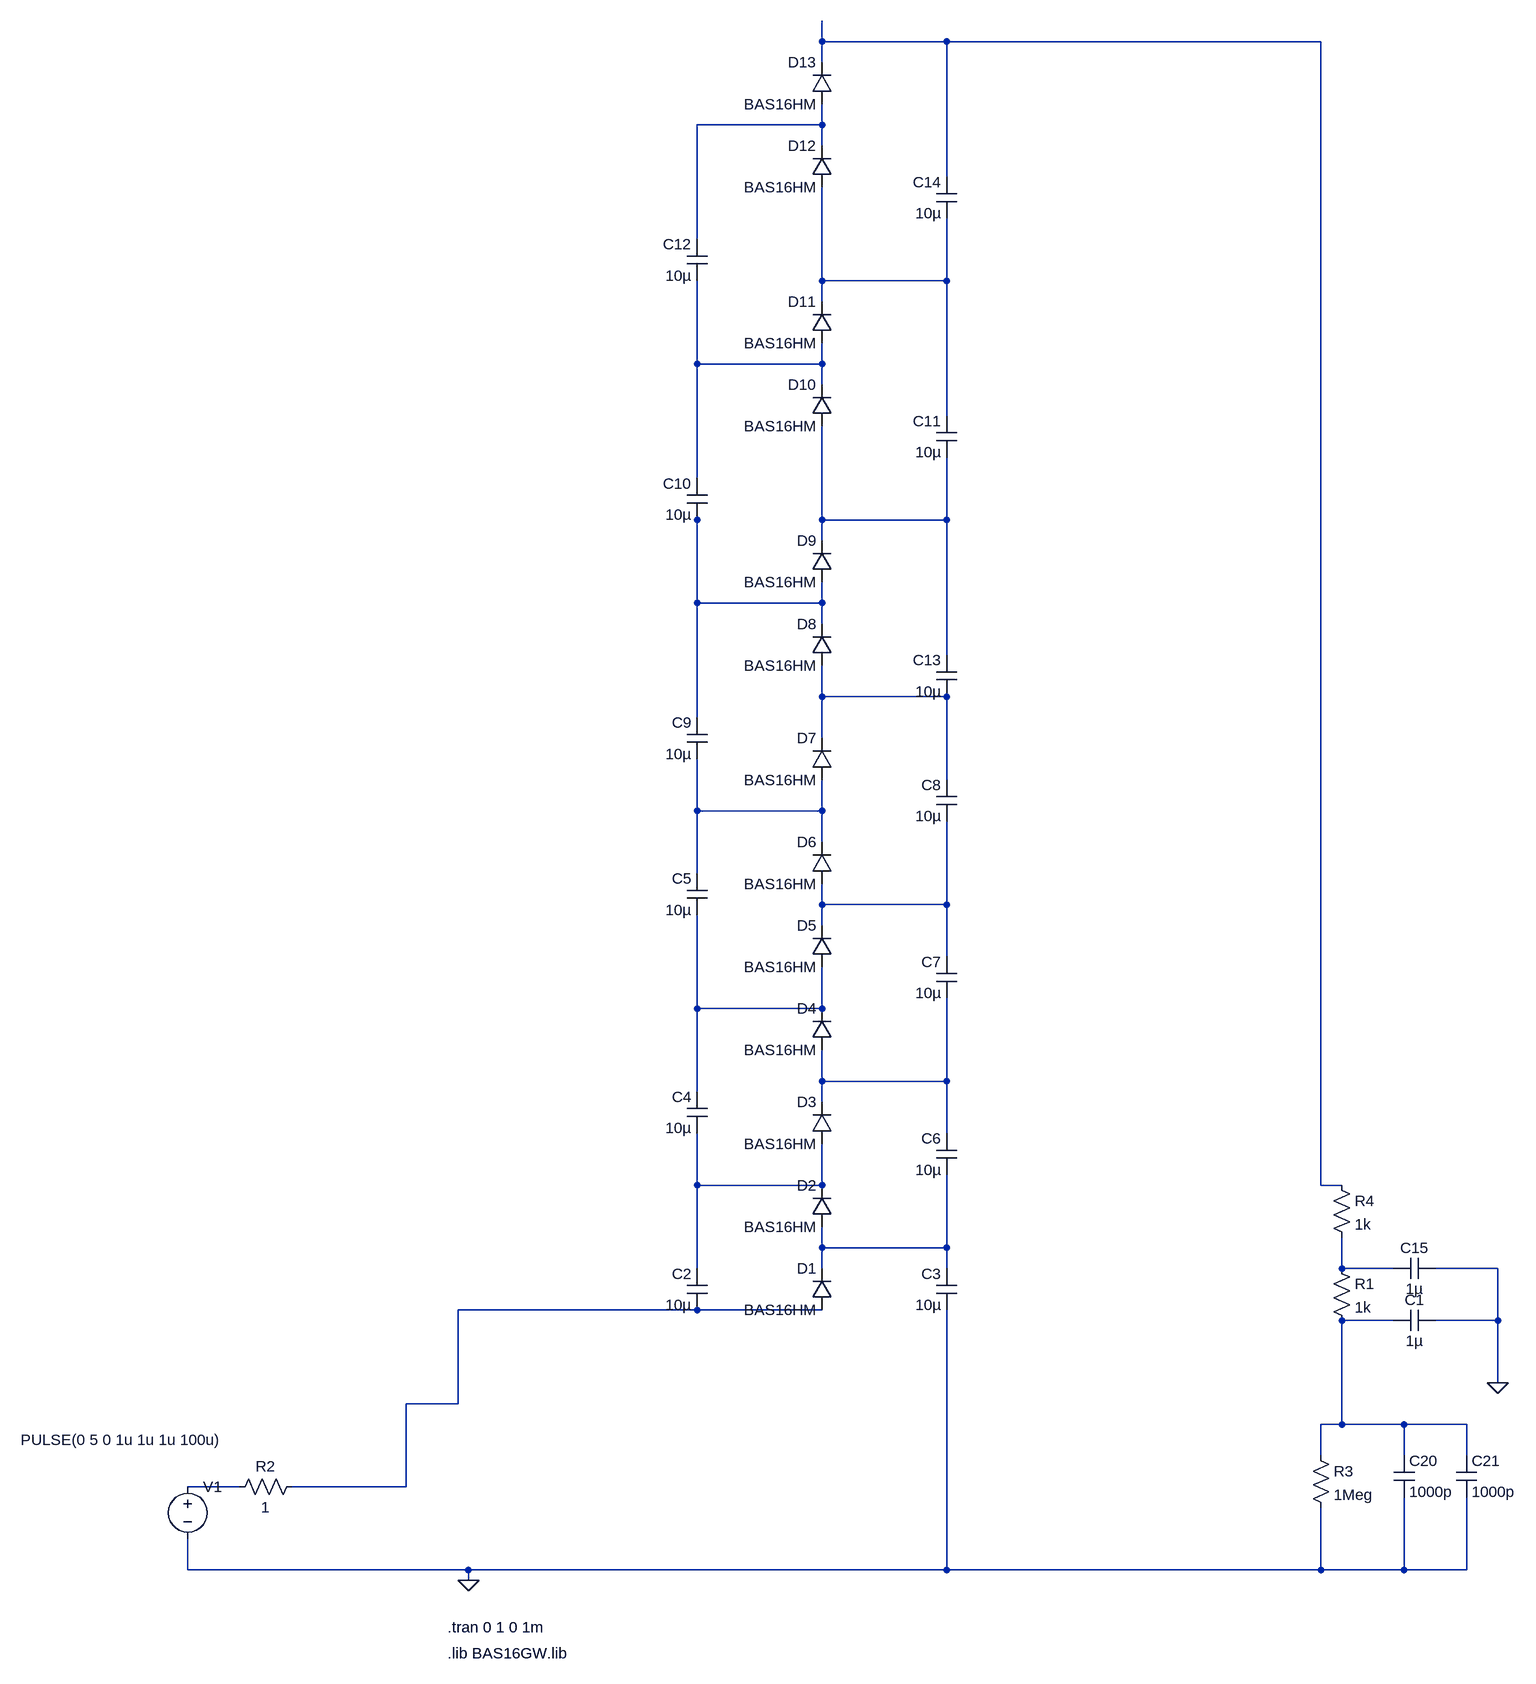
[diagram p0: schematic cosmicpiCWconverter.asc]
cosmicpiCWconverter.asc, the LTspice schematic file:
Version 4
SHEET 1 3736 680
WIRE 464 -2048 464 -2080
WIRE 656 -2048 464 -2048
WIRE 1232 -2048 656 -2048
WIRE 464 -2016 464 -2048
WIRE 464 -1920 464 -1952
WIRE 464 -1920 272 -1920
WIRE 464 -1888 464 -1920
WIRE 656 -1840 656 -2048
WIRE 272 -1744 272 -1920
WIRE 464 -1680 464 -1824
WIRE 656 -1680 656 -1776
WIRE 656 -1680 464 -1680
WIRE 464 -1648 464 -1680
WIRE 272 -1552 272 -1680
WIRE 464 -1552 464 -1584
WIRE 464 -1552 272 -1552
WIRE 464 -1520 464 -1552
WIRE 656 -1472 656 -1680
WIRE 272 -1376 272 -1552
WIRE 272 -1312 272 -1328
WIRE 464 -1312 464 -1456
WIRE 656 -1312 656 -1408
WIRE 656 -1312 464 -1312
WIRE 464 -1280 464 -1312
WIRE 272 -1184 272 -1312
WIRE 464 -1184 464 -1216
WIRE 464 -1184 272 -1184
WIRE 464 -1152 464 -1184
WIRE 656 -1104 656 -1312
WIRE 464 -1040 464 -1088
WIRE 656 -1040 464 -1040
WIRE 272 -1008 272 -1184
WIRE 464 -976 464 -1040
WIRE 656 -912 656 -1040
WIRE 272 -864 272 -944
WIRE 464 -864 464 -912
WIRE 464 -864 272 -864
WIRE 464 -816 464 -864
WIRE 272 -768 272 -864
WIRE 464 -720 464 -752
WIRE 656 -720 656 -848
WIRE 656 -720 464 -720
WIRE 464 -688 464 -720
WIRE 656 -640 656 -720
WIRE 272 -560 272 -704
WIRE 464 -560 464 -624
WIRE 464 -560 272 -560
WIRE 464 -448 464 -496
WIRE 656 -448 656 -576
WIRE 656 -448 464 -448
WIRE 272 -432 272 -560
WIRE 464 -416 464 -448
WIRE 656 -368 656 -448
WIRE 272 -288 272 -368
WIRE 464 -288 464 -352
WIRE 464 -288 272 -288
WIRE 1232 -288 1232 -2048
WIRE 1264 -288 1232 -288
WIRE 464 -192 464 -224
WIRE 656 -192 656 -304
WIRE 656 -192 464 -192
WIRE 272 -160 272 -288
WIRE 464 -160 464 -192
WIRE 656 -160 656 -192
WIRE 1264 -160 1264 -208
WIRE 1344 -160 1264 -160
WIRE 1504 -160 1408 -160
WIRE 272 -96 -96 -96
WIRE 464 -96 272 -96
WIRE 1344 -80 1264 -80
WIRE 1504 -80 1504 -160
WIRE 1504 -80 1408 -80
WIRE 1504 16 1504 -80
WIRE -96 48 -96 -96
WIRE -96 48 -176 48
WIRE 1264 80 1264 -80
WIRE 1264 80 1232 80
WIRE 1360 80 1264 80
WIRE 1456 80 1360 80
WIRE 1232 128 1232 80
WIRE 1360 128 1360 80
WIRE 1456 128 1456 80
WIRE -432 176 -512 176
WIRE -176 176 -176 48
WIRE -176 176 -352 176
WIRE -512 304 -512 256
WIRE -80 304 -512 304
WIRE 656 304 656 -96
WIRE 656 304 -80 304
WIRE 1232 304 1232 208
WIRE 1232 304 656 304
WIRE 1360 304 1360 192
WIRE 1360 304 1232 304
WIRE 1456 304 1456 192
WIRE 1456 304 1360 304
WIRE -80 320 -80 304
FLAG -80 320 0
FLAG 1504 16 0
SYMBOL diode 480 -96 R180
WINDOW 0 24 64 Left 2
WINDOW 3 24 0 Left 2
SYMATTR InstName D1
SYMATTR Value BAS16HM
SYMBOL voltage -512 160 R0
WINDOW 3 -257 -56 Left 2
WINDOW 123 0 0 Left 0
WINDOW 39 0 0 Left 0
SYMATTR Value PULSE(0 5 0 1u 1u 1u 100u)
SYMATTR InstName V1
SYMBOL res -336 160 R90
WINDOW 0 0 56 VBottom 2
WINDOW 3 32 56 VTop 2
SYMATTR InstName R2
SYMATTR Value 1
SYMBOL cap 288 -96 R180
WINDOW 0 24 56 Left 2
WINDOW 3 24 8 Left 2
SYMATTR InstName C2
SYMATTR Value 10µ
SYMBOL cap 672 -96 R180
WINDOW 0 24 56 Left 2
WINDOW 3 24 8 Left 2
SYMATTR InstName C3
SYMATTR Value 10µ
SYMBOL diode 480 -224 R180
WINDOW 0 24 64 Left 2
WINDOW 3 24 0 Left 2
SYMATTR InstName D2
SYMATTR Value BAS16HM
SYMBOL cap 288 -368 R180
WINDOW 0 24 56 Left 2
WINDOW 3 24 8 Left 2
SYMATTR InstName C4
SYMATTR Value 10µ
SYMBOL diode 480 -352 R180
WINDOW 0 24 64 Left 2
WINDOW 3 24 0 Left 2
SYMATTR InstName D3
SYMATTR Value BAS16HM
SYMBOL diode 480 -496 R180
WINDOW 0 24 64 Left 2
WINDOW 3 24 0 Left 2
SYMATTR InstName D4
SYMATTR Value BAS16HM
SYMBOL cap 672 -304 R180
WINDOW 0 24 56 Left 2
WINDOW 3 24 8 Left 2
SYMATTR InstName C6
SYMATTR Value 10µ
SYMBOL diode 480 -624 R180
WINDOW 0 24 64 Left 2
WINDOW 3 24 0 Left 2
SYMATTR InstName D5
SYMATTR Value BAS16HM
SYMBOL diode 480 -752 R180
WINDOW 0 24 64 Left 2
WINDOW 3 24 0 Left 2
SYMATTR InstName D6
SYMATTR Value BAS16HM
SYMBOL cap 288 -704 R180
WINDOW 0 24 56 Left 2
WINDOW 3 24 8 Left 2
SYMATTR InstName C5
SYMATTR Value 10µ
SYMBOL cap 672 -576 R180
WINDOW 0 24 56 Left 2
WINDOW 3 24 8 Left 2
SYMATTR InstName C7
SYMATTR Value 10µ
SYMBOL diode 480 -912 R180
WINDOW 0 24 64 Left 2
WINDOW 3 24 0 Left 2
SYMATTR InstName D7
SYMATTR Value BAS16HM
SYMBOL cap 672 -848 R180
WINDOW 0 24 56 Left 2
WINDOW 3 24 8 Left 2
SYMATTR InstName C8
SYMATTR Value 10µ
SYMBOL diode 480 -1088 R180
WINDOW 0 24 64 Left 2
WINDOW 3 24 0 Left 2
SYMATTR InstName D8
SYMATTR Value BAS16HM
SYMBOL diode 480 -1216 R180
WINDOW 0 24 64 Left 2
WINDOW 3 24 0 Left 2
SYMATTR InstName D9
SYMATTR Value BAS16HM
SYMBOL cap 288 -944 R180
WINDOW 0 24 56 Left 2
WINDOW 3 24 8 Left 2
SYMATTR InstName C9
SYMATTR Value 10µ
SYMBOL cap 672 -1040 R180
WINDOW 0 24 56 Left 2
WINDOW 3 24 8 Left 2
SYMATTR InstName C13
SYMATTR Value 10µ
SYMBOL res 1216 112 R0
SYMATTR InstName R3
SYMATTR Value 1Meg
SYMBOL cap 1344 128 R0
SYMATTR InstName C20
SYMATTR Value 1000p
SYMBOL cap 1440 128 R0
SYMATTR InstName C21
SYMATTR Value 1000p
SYMBOL cap 1408 -96 R90
WINDOW 0 0 32 VBottom 2
WINDOW 3 32 32 VTop 2
SYMATTR InstName C1
SYMATTR Value 1µ
SYMBOL cap 1408 -176 R90
WINDOW 0 0 32 VBottom 2
WINDOW 3 32 32 VTop 2
SYMATTR InstName C15
SYMATTR Value 1µ
SYMBOL res 1248 -176 R0
SYMATTR InstName R1
SYMATTR Value 1k
SYMBOL res 1248 -304 R0
SYMATTR InstName R4
SYMATTR Value 1k
SYMBOL diode 480 -1456 R180
WINDOW 0 24 64 Left 2
WINDOW 3 24 0 Left 2
SYMATTR InstName D10
SYMATTR Value BAS16HM
SYMBOL diode 480 -1584 R180
WINDOW 0 24 64 Left 2
WINDOW 3 24 0 Left 2
SYMATTR InstName D11
SYMATTR Value BAS16HM
SYMBOL cap 288 -1312 R180
WINDOW 0 24 56 Left 2
WINDOW 3 24 8 Left 2
SYMATTR InstName C10
SYMATTR Value 10µ
SYMBOL cap 672 -1408 R180
WINDOW 0 24 56 Left 2
WINDOW 3 24 8 Left 2
SYMATTR InstName C11
SYMATTR Value 10µ
SYMBOL diode 480 -1824 R180
WINDOW 0 24 64 Left 2
WINDOW 3 24 0 Left 2
SYMATTR InstName D12
SYMATTR Value BAS16HM
SYMBOL diode 480 -1952 R180
WINDOW 0 24 64 Left 2
WINDOW 3 24 0 Left 2
SYMATTR InstName D13
SYMATTR Value BAS16HM
SYMBOL cap 288 -1680 R180
WINDOW 0 24 56 Left 2
WINDOW 3 24 8 Left 2
SYMATTR InstName C12
SYMATTR Value 10µ
SYMBOL cap 672 -1776 R180
WINDOW 0 24 56 Left 2
WINDOW 3 24 8 Left 2
SYMATTR InstName C14
SYMATTR Value 10µ
TEXT -112 392 Left 2 !.tran 0 1 0 1m
TEXT -112 432 Left 2 !.lib BAS16GW.lib

The netlist it stands for:
* cosmicpiCWconverter.asc
D1 N015 N013 BAS16HM
V1 N017 0 PULSE(0 5 0 1u 1u 1u 100u)
R2 N015 N017 1
C2 N015 N012 10µ
C3 0 N013 10µ
D2 N013 N012 BAS16HM
C4 N012 N010 10µ
D3 N012 N011 BAS16HM
D4 N011 N010 BAS16HM
C6 N013 N011 10µ
D5 N010 N009 BAS16HM
D6 N009 N008 BAS16HM
C5 N010 N008 10µ
C7 N011 N009 10µ
D7 N008 N007 BAS16HM
C8 N009 N007 10µ
D8 N007 N005 BAS16HM
D9 N005 N006 BAS16HM
C9 N008 N005 10µ
C13 N007 N006 10µ
R3 N016 0 1Meg
C20 N016 0 1000p
C21 N016 0 1000p
C1 0 N016 1µ
C15 0 N014 1µ
R1 N014 N016 1k
R4 N001 N014 1k
D10 N006 N004 BAS16HM
D11 N004 N003 BAS16HM
C10 N005 N004 10µ
C11 N006 N003 10µ
D12 N003 N002 BAS16HM
D13 N002 N001 BAS16HM
C12 N004 N002 10µ
C14 N003 N001 10µ
.model D D
.lib standard.dio
.tran 0 1 0 1m
.lib BAS16GW.lib
.backanno
.end